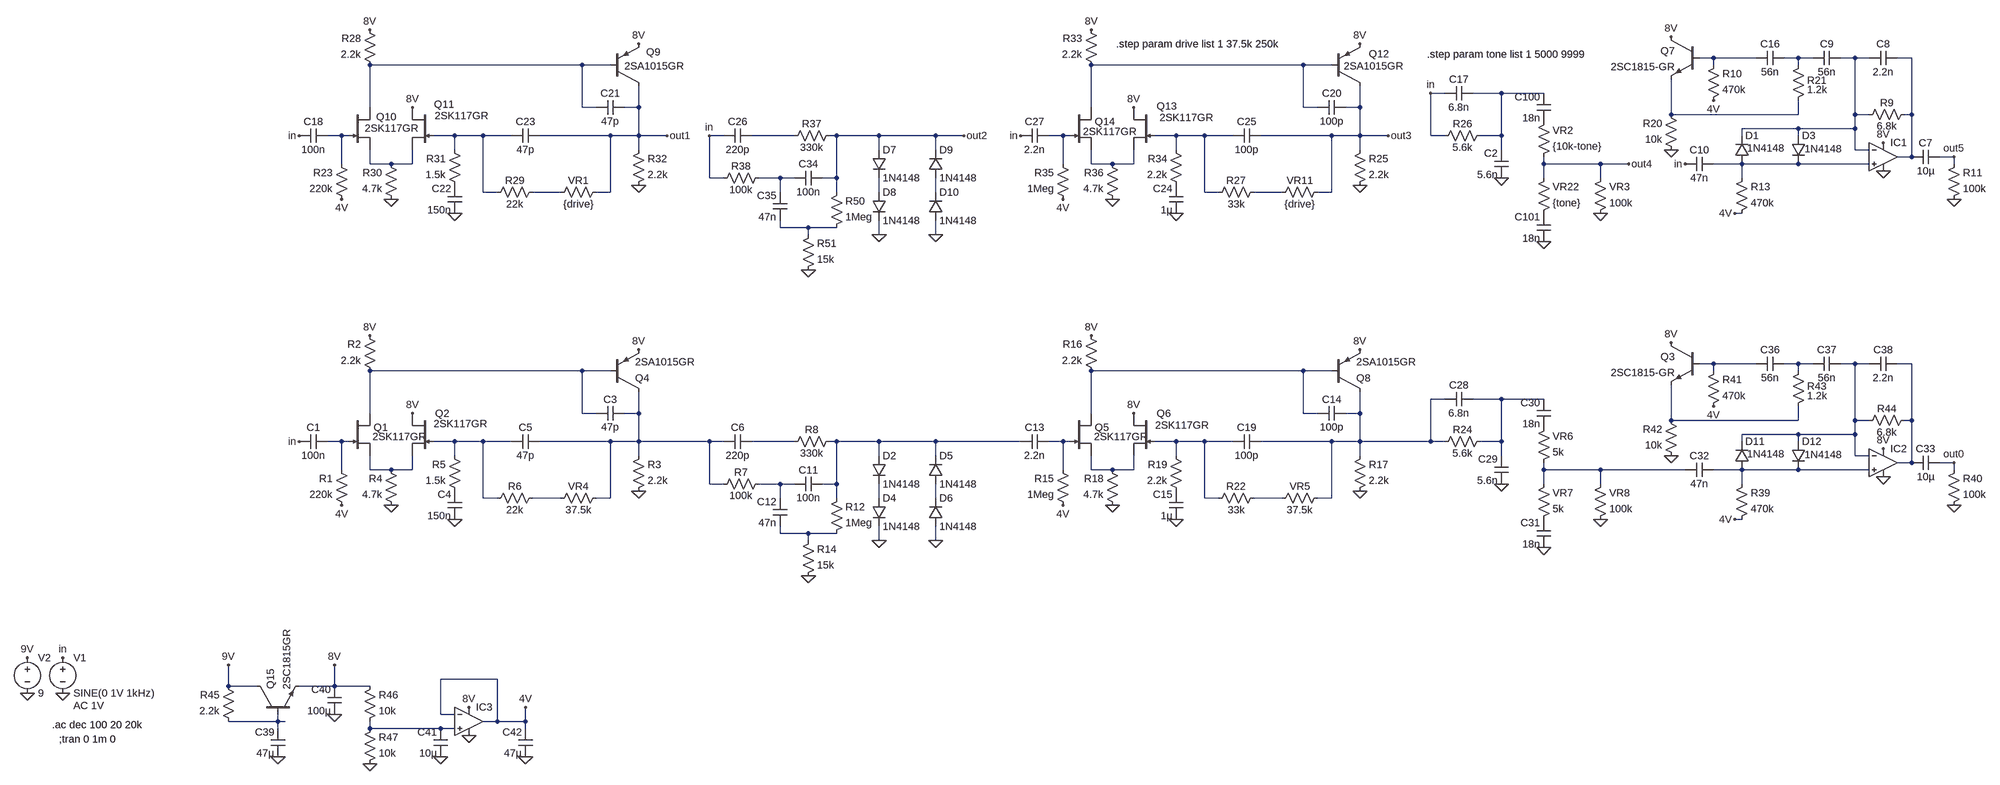
[diagram p0: schematic bd2.asc]
bd2.asc, the LTspice schematic file:
Version 4
SHEET 1 3148 1828
WIRE 2144 48 2112 48
WIRE 2240 48 2144 48
WIRE 2336 48 2304 48
WIRE 2368 48 2336 48
WIRE 2464 48 2432 48
WIRE 2496 48 2464 48
WIRE 2592 48 2560 48
WIRE -416 64 -896 64
WIRE -352 64 -416 64
WIRE 1216 64 736 64
WIRE 1280 64 1216 64
WIRE 2144 64 2144 48
WIRE 2336 64 2336 48
WIRE 1536 128 1504 128
WIRE 1664 128 1600 128
WIRE 1760 128 1664 128
WIRE -896 160 -896 64
WIRE -416 160 -416 64
WIRE -384 160 -416 160
WIRE -288 160 -288 112
WIRE -288 160 -320 160
WIRE 736 160 736 64
WIRE 1216 160 1216 64
WIRE 1248 160 1216 160
WIRE 1344 160 1344 112
WIRE 1344 160 1312 160
WIRE 2048 176 2048 96
WIRE 2336 176 2336 144
WIRE 2336 176 2048 176
WIRE 2464 176 2464 48
WIRE 2496 176 2464 176
WIRE 2592 176 2592 48
WIRE 2592 176 2576 176
WIRE 2336 208 2208 208
WIRE 2464 208 2464 176
WIRE 2464 208 2336 208
WIRE -960 224 -992 224
WIRE -944 224 -960 224
WIRE -704 224 -752 224
WIRE -640 224 -704 224
WIRE -576 224 -640 224
WIRE -352 224 -512 224
WIRE -288 224 -288 160
WIRE -288 224 -352 224
WIRE -224 224 -288 224
WIRE -96 224 -128 224
WIRE 64 224 -32 224
WIRE 160 224 144 224
WIRE 256 224 160 224
WIRE 384 224 256 224
WIRE 448 224 384 224
WIRE 672 224 640 224
WIRE 688 224 672 224
WIRE 928 224 880 224
WIRE 992 224 928 224
WIRE 1056 224 992 224
WIRE 1280 224 1120 224
WIRE 1344 224 1344 160
WIRE 1344 224 1280 224
WIRE 1408 224 1344 224
WIRE 1504 224 1504 128
WIRE 1536 224 1504 224
WIRE 1664 224 1664 128
WIRE 1664 224 1616 224
WIRE 2208 224 2208 208
WIRE 2336 224 2336 208
WIRE -704 256 -704 224
WIRE -288 256 -288 224
WIRE 256 256 256 224
WIRE 384 256 384 224
WIRE 928 256 928 224
WIRE 1344 256 1344 224
WIRE 1664 256 1664 224
WIRE 2464 256 2464 208
WIRE 2496 256 2464 256
WIRE 2592 272 2592 176
WIRE 2592 272 2560 272
WIRE 2688 272 2656 272
WIRE -960 288 -960 224
WIRE -896 288 -896 256
WIRE -848 288 -896 288
WIRE -800 288 -800 256
WIRE -800 288 -848 288
WIRE 672 288 672 224
WIRE 736 288 736 256
WIRE 784 288 736 288
WIRE 832 288 832 256
WIRE 832 288 784 288
WIRE 1760 288 1760 272
WIRE 1888 288 1760 288
WIRE 1952 288 1888 288
WIRE 2208 288 2144 288
WIRE 2336 288 2208 288
WIRE 2496 288 2336 288
WIRE 2688 288 2688 272
WIRE -128 320 -128 224
WIRE -96 320 -128 320
WIRE 32 320 -16 320
WIRE 64 320 32 320
WIRE 160 320 160 224
WIRE 160 320 128 320
WIRE 1760 320 1760 288
WIRE 1888 320 1888 288
WIRE 2208 320 2208 288
WIRE -640 352 -640 224
WIRE -608 352 -640 352
WIRE -464 352 -528 352
WIRE -352 352 -352 224
WIRE -352 352 -384 352
WIRE 32 352 32 320
WIRE 160 352 160 320
WIRE 256 352 256 320
WIRE 384 352 384 320
WIRE 992 352 992 224
WIRE 1024 352 992 352
WIRE 1168 352 1104 352
WIRE 1280 352 1280 224
WIRE 1280 352 1248 352
WIRE 2208 400 2192 400
WIRE 32 432 32 416
WIRE 96 432 32 432
WIRE 160 432 96 432
WIRE 96 448 96 432
WIRE 256 448 256 416
WIRE 384 448 384 416
WIRE 2144 864 2112 864
WIRE 2240 864 2144 864
WIRE 2336 864 2304 864
WIRE 2368 864 2336 864
WIRE 2464 864 2432 864
WIRE 2496 864 2464 864
WIRE 2592 864 2560 864
WIRE -416 880 -896 880
WIRE -352 880 -416 880
WIRE 1216 880 736 880
WIRE 1280 880 1216 880
WIRE 2144 880 2144 864
WIRE 2336 880 2336 864
WIRE 1536 944 1504 944
WIRE 1664 944 1600 944
WIRE 1760 944 1664 944
WIRE -896 976 -896 880
WIRE -416 976 -416 880
WIRE -384 976 -416 976
WIRE -288 976 -288 928
WIRE -288 976 -320 976
WIRE 736 976 736 880
WIRE 1216 976 1216 880
WIRE 1248 976 1216 976
WIRE 1344 976 1344 928
WIRE 1344 976 1312 976
WIRE 2048 992 2048 912
WIRE 2336 992 2336 960
WIRE 2336 992 2048 992
WIRE 2464 992 2464 864
WIRE 2496 992 2464 992
WIRE 2592 992 2592 864
WIRE 2592 992 2576 992
WIRE 2336 1024 2208 1024
WIRE 2464 1024 2464 992
WIRE 2464 1024 2336 1024
WIRE -960 1040 -992 1040
WIRE -944 1040 -960 1040
WIRE -704 1040 -752 1040
WIRE -640 1040 -704 1040
WIRE -576 1040 -640 1040
WIRE -352 1040 -512 1040
WIRE -288 1040 -288 976
WIRE -288 1040 -352 1040
WIRE -128 1040 -288 1040
WIRE -96 1040 -128 1040
WIRE 64 1040 -32 1040
WIRE 160 1040 144 1040
WIRE 256 1040 160 1040
WIRE 384 1040 256 1040
WIRE 576 1040 384 1040
WIRE 672 1040 640 1040
WIRE 688 1040 672 1040
WIRE 928 1040 880 1040
WIRE 992 1040 928 1040
WIRE 1056 1040 992 1040
WIRE 1280 1040 1120 1040
WIRE 1344 1040 1344 976
WIRE 1344 1040 1280 1040
WIRE 1504 1040 1504 944
WIRE 1504 1040 1344 1040
WIRE 1536 1040 1504 1040
WIRE 1664 1040 1664 944
WIRE 1664 1040 1616 1040
WIRE 2208 1040 2208 1024
WIRE 2336 1040 2336 1024
WIRE -704 1072 -704 1040
WIRE -288 1072 -288 1040
WIRE 256 1072 256 1040
WIRE 384 1072 384 1040
WIRE 928 1072 928 1040
WIRE 1344 1072 1344 1040
WIRE 1664 1072 1664 1040
WIRE 2464 1072 2464 1024
WIRE 2496 1072 2464 1072
WIRE 2592 1088 2592 992
WIRE 2592 1088 2560 1088
WIRE 2688 1088 2656 1088
WIRE -960 1104 -960 1040
WIRE -896 1104 -896 1072
WIRE -848 1104 -896 1104
WIRE -800 1104 -800 1072
WIRE -800 1104 -848 1104
WIRE 672 1104 672 1040
WIRE 736 1104 736 1072
WIRE 784 1104 736 1104
WIRE 832 1104 832 1072
WIRE 832 1104 784 1104
WIRE 1760 1104 1760 1088
WIRE 1888 1104 1760 1104
WIRE 2080 1104 1888 1104
WIRE 2208 1104 2144 1104
WIRE 2336 1104 2208 1104
WIRE 2496 1104 2336 1104
WIRE 2688 1104 2688 1088
WIRE -128 1136 -128 1040
WIRE -96 1136 -128 1136
WIRE 32 1136 -16 1136
WIRE 64 1136 32 1136
WIRE 160 1136 160 1040
WIRE 160 1136 128 1136
WIRE 1760 1136 1760 1104
WIRE 1888 1136 1888 1104
WIRE 2208 1136 2208 1104
WIRE -640 1168 -640 1040
WIRE -608 1168 -640 1168
WIRE -464 1168 -528 1168
WIRE -352 1168 -352 1040
WIRE -352 1168 -384 1168
WIRE 32 1168 32 1136
WIRE 160 1168 160 1136
WIRE 256 1168 256 1136
WIRE 384 1168 384 1136
WIRE 992 1168 992 1040
WIRE 1024 1168 992 1168
WIRE 1168 1168 1104 1168
WIRE 1280 1168 1280 1040
WIRE 1280 1168 1248 1168
WIRE 2208 1216 2192 1216
WIRE 32 1248 32 1232
WIRE 96 1248 32 1248
WIRE 160 1248 96 1248
WIRE 96 1264 96 1248
WIRE 256 1264 256 1232
WIRE 384 1264 384 1232
WIRE -608 1616 -736 1616
WIRE -1216 1632 -1216 1584
WIRE -1152 1632 -1216 1632
WIRE -976 1632 -976 1584
WIRE -976 1632 -1056 1632
WIRE -896 1632 -976 1632
WIRE -736 1696 -736 1616
WIRE -704 1696 -736 1696
WIRE -1104 1712 -1104 1696
WIRE -1104 1712 -1216 1712
WIRE -1088 1712 -1104 1712
WIRE -608 1712 -608 1616
WIRE -608 1712 -640 1712
WIRE -544 1712 -544 1680
WIRE -544 1712 -608 1712
WIRE -1104 1728 -1104 1712
WIRE -896 1728 -896 1712
WIRE -736 1728 -896 1728
WIRE -704 1728 -736 1728
WIRE -544 1728 -544 1712
FLAG -1616 1648 0
FLAG -1616 1568 in
FLAG -224 224 out1
FLAG -848 368 0
FLAG -704 400 0
FLAG -288 336 0
FLAG -960 368 4V
FLAG -800 160 8V
FLAG -896 -16 8V
FLAG -288 16 8V
FLAG -1056 224 in
FLAG 96 528 0
FLAG -128 224 in
FLAG 448 224 out2
FLAG 256 448 0
FLAG 384 448 0
FLAG 1408 224 out3
FLAG 784 368 0
FLAG 928 400 0
FLAG 1344 336 0
FLAG 672 368 4V
FLAG 832 160 8V
FLAG 736 -16 8V
FLAG 1344 16 8V
FLAG 576 224 in
FLAG 1664 320 0
FLAG 1760 464 0
FLAG 1888 400 0
FLAG 1952 288 out4
FLAG 1504 128 in
FLAG 2192 400 4V
FLAG 2528 304 0
FLAG 2528 240 8V
FLAG 2688 368 0
FLAG 2048 0 8V
FLAG 2048 256 0
FLAG 2144 144 4V
FLAG 2688 272 out5
FLAG 2080 288 in
FLAG -848 1184 0
FLAG -704 1216 0
FLAG -288 1152 0
FLAG -960 1184 4V
FLAG -800 976 8V
FLAG -896 800 8V
FLAG -288 832 8V
FLAG -1056 1040 in
FLAG 96 1344 0
FLAG 256 1264 0
FLAG 384 1264 0
FLAG 784 1184 0
FLAG 928 1216 0
FLAG 1344 1152 0
FLAG 672 1184 4V
FLAG 832 976 8V
FLAG 736 800 8V
FLAG 1344 832 8V
FLAG 1664 1136 0
FLAG 1760 1280 0
FLAG 1888 1216 0
FLAG 2688 1088 out0
FLAG -1104 1792 0
FLAG -976 1696 0
FLAG -976 1584 8V
FLAG 2192 1216 4V
FLAG 2528 1120 0
FLAG 2528 1056 8V
FLAG 2688 1184 0
FLAG 2048 816 8V
FLAG 2048 1072 0
FLAG 2144 960 4V
FLAG -896 1808 0
FLAG -736 1792 0
FLAG -672 1744 0
FLAG -672 1680 8V
FLAG -544 1792 0
FLAG -544 1680 4V
FLAG -1216 1584 9V
FLAG -1696 1648 0
FLAG -1696 1568 9V
SYMBOL res -944 384 R180
WINDOW 0 36 76 Left 2
WINDOW 3 36 40 Left 2
SYMATTR InstName R23
SYMATTR Value 220k
SYMBOL cap -992 208 R90
WINDOW 0 0 32 VBottom 2
WINDOW 3 32 32 VTop 2
SYMATTR InstName C18
SYMATTR Value 100n
SYMBOL voltage -1616 1552 R0
WINDOW 123 24 124 Left 2
WINDOW 39 0 0 Left 2
SYMATTR Value2 AC 1V
SYMATTR InstName V1
SYMATTR Value SINE(0 1V 1kHz)
SYMBOL res -880 80 R180
WINDOW 0 36 76 Left 2
WINDOW 3 36 40 Left 2
SYMATTR InstName R28
SYMATTR Value 2.2k
SYMBOL res -304 352 M180
WINDOW 0 36 76 Left 2
WINDOW 3 36 40 Left 2
SYMATTR InstName R32
SYMATTR Value 2.2k
SYMBOL njf -944 160 R0
WINDOW 3 36 47 Left 2
WINDOW 0 62 21 Left 2
SYMATTR Value 2SK117GR
SYMATTR InstName Q10
SYMBOL njf -752 160 M0
WINDOW 0 -47 -7 Left 2
WINDOW 3 -124 19 Left 2
SYMATTR InstName Q11
SYMATTR Value 2SK117GR
SYMBOL pnp -352 112 M180
WINDOW 0 81 77 Left 2
WINDOW 3 32 46 Left 2
SYMATTR InstName Q9
SYMATTR Value 2SA1015GR
SYMBOL cap -320 144 R90
WINDOW 0 0 32 VBottom 2
WINDOW 3 32 32 VTop 2
SYMATTR InstName C21
SYMATTR Value 47p
SYMBOL cap -688 400 R180
WINDOW 0 24 56 Left 2
WINDOW 3 24 8 Left 2
SYMATTR InstName C22
SYMATTR Value 150n
SYMBOL res -832 384 R180
WINDOW 0 36 76 Left 2
WINDOW 3 36 40 Left 2
SYMATTR InstName R30
SYMATTR Value 4.7k
SYMBOL cap -512 208 R90
WINDOW 0 0 32 VBottom 2
WINDOW 3 32 32 VTop 2
SYMATTR InstName C23
SYMATTR Value 47p
SYMBOL res -688 352 R180
WINDOW 0 36 76 Left 2
WINDOW 3 36 40 Left 2
SYMATTR InstName R31
SYMATTR Value 1.5k
SYMBOL res -512 336 R90
WINDOW 0 5 56 VBottom 2
WINDOW 3 27 56 VTop 2
SYMATTR InstName R29
SYMATTR Value 22k
SYMBOL res -368 336 R90
WINDOW 0 5 56 VBottom 2
WINDOW 3 27 56 VTop 2
SYMATTR InstName VR1
SYMATTR Value {drive}
SYMBOL cap -32 208 R90
WINDOW 0 0 32 VBottom 2
WINDOW 3 32 32 VTop 2
SYMATTR InstName C26
SYMATTR Value 220p
SYMBOL res 0 304 R90
WINDOW 0 5 56 VBottom 2
WINDOW 3 27 56 VTop 2
SYMATTR InstName R38
SYMATTR Value 100k
SYMBOL res 160 208 R90
WINDOW 0 5 56 VBottom 2
WINDOW 3 27 56 VTop 2
SYMATTR InstName R37
SYMATTR Value 330k
SYMBOL cap 128 304 R90
WINDOW 0 0 32 VBottom 2
WINDOW 3 32 32 VTop 2
SYMATTR InstName C34
SYMATTR Value 100n
SYMBOL res 144 448 M180
WINDOW 0 36 76 Left 2
WINDOW 3 36 40 Left 2
SYMATTR InstName R50
SYMATTR Value 1Meg
SYMBOL cap 48 416 R180
WINDOW 0 24 56 Left 2
WINDOW 3 24 8 Left 2
SYMATTR InstName C35
SYMATTR Value 47n
SYMBOL res 80 544 M180
WINDOW 0 36 76 Left 2
WINDOW 3 36 40 Left 2
SYMATTR InstName R51
SYMATTR Value 15k
SYMBOL diode 240 256 R0
SYMATTR InstName D7
SYMATTR Value 1N4148
SYMBOL diode 240 352 R0
SYMATTR InstName D8
SYMATTR Value 1N4148
SYMBOL diode 368 320 M180
WINDOW 0 24 64 Left 2
WINDOW 3 24 0 Left 2
SYMATTR InstName D9
SYMATTR Value 1N4148
SYMBOL diode 368 416 M180
WINDOW 0 24 64 Left 2
WINDOW 3 24 0 Left 2
SYMATTR InstName D10
SYMATTR Value 1N4148
SYMBOL res 688 384 R180
WINDOW 0 36 76 Left 2
WINDOW 3 36 40 Left 2
SYMATTR InstName R35
SYMATTR Value 1Meg
SYMBOL cap 640 208 R90
WINDOW 0 0 32 VBottom 2
WINDOW 3 32 32 VTop 2
SYMATTR InstName C27
SYMATTR Value 2.2n
SYMBOL res 752 80 R180
WINDOW 0 36 76 Left 2
WINDOW 3 36 40 Left 2
SYMATTR InstName R33
SYMATTR Value 2.2k
SYMBOL res 1328 352 M180
WINDOW 0 36 76 Left 2
WINDOW 3 36 40 Left 2
SYMATTR InstName R25
SYMATTR Value 2.2k
SYMBOL njf 688 160 R0
WINDOW 3 29 55 Left 2
SYMATTR Value 2SK117GR
SYMATTR InstName Q14
SYMBOL njf 880 160 M0
WINDOW 0 -50 -3 Left 2
WINDOW 3 -132 23 Left 2
SYMATTR InstName Q13
SYMATTR Value 2SK117GR
SYMBOL pnp 1280 112 M180
WINDOW 0 84 73 Left 2
WINDOW 3 27 46 Left 2
SYMATTR InstName Q12
SYMATTR Value 2SA1015GR
SYMBOL cap 1312 144 R90
WINDOW 0 0 32 VBottom 2
WINDOW 3 32 32 VTop 2
SYMATTR InstName C20
SYMATTR Value 100p
SYMBOL cap 944 400 R180
WINDOW 0 24 56 Left 2
WINDOW 3 24 8 Left 2
SYMATTR InstName C24
SYMATTR Value 1µ
SYMBOL res 800 384 R180
WINDOW 0 36 76 Left 2
WINDOW 3 36 40 Left 2
SYMATTR InstName R36
SYMATTR Value 4.7k
SYMBOL cap 1120 208 R90
WINDOW 0 0 32 VBottom 2
WINDOW 3 32 32 VTop 2
SYMATTR InstName C25
SYMATTR Value 100p
SYMBOL res 944 352 R180
WINDOW 0 36 76 Left 2
WINDOW 3 36 40 Left 2
SYMATTR InstName R34
SYMATTR Value 2.2k
SYMBOL res 1120 336 R90
WINDOW 0 5 56 VBottom 2
WINDOW 3 27 56 VTop 2
SYMATTR InstName R27
SYMATTR Value 33k
SYMBOL res 1264 336 R90
WINDOW 0 5 56 VBottom 2
WINDOW 3 27 56 VTop 2
SYMATTR InstName VR11
SYMATTR Value {drive}
SYMBOL res 1632 208 R90
WINDOW 0 5 56 VBottom 2
WINDOW 3 27 56 VTop 2
SYMATTR InstName R26
SYMATTR Value 5.6k
SYMBOL cap 1600 112 R90
WINDOW 0 0 32 VBottom 2
WINDOW 3 32 32 VTop 2
SYMATTR InstName C17
SYMATTR Value 6.8n
SYMBOL cap 1680 320 R180
WINDOW 0 24 56 Left 2
WINDOW 3 24 8 Left 2
SYMATTR InstName C2
SYMATTR Value 5.6n
SYMBOL cap 1776 192 R180
WINDOW 0 24 56 Left 2
WINDOW 3 24 8 Left 2
SYMATTR InstName C100
SYMATTR Value 18n
SYMBOL res 1744 288 M180
WINDOW 0 36 76 Left 2
WINDOW 3 36 40 Left 2
SYMATTR InstName VR2
SYMATTR Value {10k-tone}
SYMBOL res 1744 416 M180
WINDOW 0 36 76 Left 2
WINDOW 3 36 40 Left 2
SYMATTR InstName VR22
SYMATTR Value {tone}
SYMBOL cap 1776 464 R180
WINDOW 0 24 56 Left 2
WINDOW 3 24 8 Left 2
SYMATTR InstName C101
SYMATTR Value 18n
SYMBOL res 1872 416 M180
WINDOW 0 36 76 Left 2
WINDOW 3 36 40 Left 2
SYMATTR InstName VR3
SYMATTR Value 100k
SYMBOL cap 2144 272 R90
WINDOW 0 0 32 VBottom 2
WINDOW 3 32 32 VTop 2
SYMATTR InstName C10
SYMATTR Value 47n
SYMBOL res 2192 416 M180
WINDOW 0 36 76 Left 2
WINDOW 3 36 40 Left 2
SYMATTR InstName R13
SYMATTR Value 470k
SYMBOL diode 2192 288 M180
WINDOW 0 24 64 Left 2
WINDOW 3 28 36 Left 2
SYMATTR InstName D1
SYMATTR Value 1N4148
SYMBOL diode 2320 224 R0
WINDOW 3 30 30 Left 2
SYMATTR Value 1N4148
SYMATTR InstName D3
SYMBOL Opamps\\UniversalOpamp2 2528 272 R0
SYMATTR InstName IC1
SYMBOL cap 2656 256 R90
WINDOW 0 0 32 VBottom 2
WINDOW 3 32 32 VTop 2
SYMATTR InstName C7
SYMATTR Value 10µ
SYMBOL res 2672 384 M180
WINDOW 0 36 76 Left 2
WINDOW 3 36 40 Left 2
SYMATTR InstName R11
SYMATTR Value 100k
SYMBOL cap 2304 32 R90
WINDOW 0 0 32 VBottom 2
WINDOW 3 32 32 VTop 2
SYMATTR InstName C16
SYMATTR Value 56n
SYMBOL npn 2112 0 M0
SYMATTR InstName Q7
SYMATTR Value 2SC1815-GR
SYMBOL res 2128 160 M180
WINDOW 0 36 76 Left 2
WINDOW 3 36 40 Left 2
SYMATTR InstName R10
SYMATTR Value 470k
SYMBOL res 2064 272 R180
WINDOW 0 36 76 Left 2
WINDOW 3 36 40 Left 2
SYMATTR InstName R20
SYMATTR Value 10k
SYMBOL cap 2432 32 R90
WINDOW 0 0 32 VBottom 2
WINDOW 3 32 32 VTop 2
SYMATTR InstName C9
SYMATTR Value 56n
SYMBOL res 2320 160 M180
WINDOW 0 36 61 Left 2
WINDOW 3 36 40 Left 2
SYMATTR InstName R21
SYMATTR Value 1.2k
SYMBOL cap 2560 32 R90
WINDOW 0 0 32 VBottom 2
WINDOW 3 32 32 VTop 2
SYMATTR InstName C8
SYMATTR Value 2.2n
SYMBOL res 2592 160 R90
WINDOW 0 5 56 VBottom 2
WINDOW 3 27 56 VTop 2
SYMATTR InstName R9
SYMATTR Value 6.8k
SYMBOL res -944 1200 R180
WINDOW 0 36 76 Left 2
WINDOW 3 36 40 Left 2
SYMATTR InstName R1
SYMATTR Value 220k
SYMBOL cap -992 1024 R90
WINDOW 0 0 32 VBottom 2
WINDOW 3 32 32 VTop 2
SYMATTR InstName C1
SYMATTR Value 100n
SYMBOL res -880 896 R180
WINDOW 0 36 76 Left 2
WINDOW 3 36 40 Left 2
SYMATTR InstName R2
SYMATTR Value 2.2k
SYMBOL res -304 1168 M180
WINDOW 0 36 76 Left 2
WINDOW 3 36 40 Left 2
SYMATTR InstName R3
SYMATTR Value 2.2k
SYMBOL njf -944 976 R0
WINDOW 3 54 53 Left 2
SYMATTR Value 2SK117GR
SYMATTR InstName Q1
SYMBOL njf -752 976 M0
WINDOW 0 -36 0 Left 2
WINDOW 3 -122 24 Left 2
SYMATTR InstName Q2
SYMATTR Value 2SK117GR
SYMBOL pnp -352 928 M180
SYMATTR InstName Q4
SYMATTR Value 2SA1015GR
SYMBOL cap -320 960 R90
WINDOW 0 0 32 VBottom 2
WINDOW 3 32 32 VTop 2
SYMATTR InstName C3
SYMATTR Value 47p
SYMBOL cap -688 1216 R180
WINDOW 0 24 56 Left 2
WINDOW 3 24 8 Left 2
SYMATTR InstName C4
SYMATTR Value 150n
SYMBOL res -832 1200 R180
WINDOW 0 36 76 Left 2
WINDOW 3 36 40 Left 2
SYMATTR InstName R4
SYMATTR Value 4.7k
SYMBOL cap -512 1024 R90
WINDOW 0 0 32 VBottom 2
WINDOW 3 32 32 VTop 2
SYMATTR InstName C5
SYMATTR Value 47p
SYMBOL res -688 1168 R180
WINDOW 0 36 76 Left 2
WINDOW 3 36 40 Left 2
SYMATTR InstName R5
SYMATTR Value 1.5k
SYMBOL res -512 1152 R90
WINDOW 0 5 56 VBottom 2
WINDOW 3 27 56 VTop 2
SYMATTR InstName R6
SYMATTR Value 22k
SYMBOL res -368 1152 R90
WINDOW 0 5 56 VBottom 2
WINDOW 3 27 56 VTop 2
SYMATTR InstName VR4
SYMATTR Value 37.5k
SYMBOL cap -32 1024 R90
WINDOW 0 0 32 VBottom 2
WINDOW 3 32 32 VTop 2
SYMATTR InstName C6
SYMATTR Value 220p
SYMBOL res 0 1120 R90
WINDOW 0 5 56 VBottom 2
WINDOW 3 27 56 VTop 2
SYMATTR InstName R7
SYMATTR Value 100k
SYMBOL res 160 1024 R90
WINDOW 0 5 56 VBottom 2
WINDOW 3 27 56 VTop 2
SYMATTR InstName R8
SYMATTR Value 330k
SYMBOL cap 128 1120 R90
WINDOW 0 0 32 VBottom 2
WINDOW 3 32 32 VTop 2
SYMATTR InstName C11
SYMATTR Value 100n
SYMBOL res 144 1264 M180
WINDOW 0 36 76 Left 2
WINDOW 3 36 40 Left 2
SYMATTR InstName R12
SYMATTR Value 1Meg
SYMBOL cap 48 1232 R180
WINDOW 0 24 56 Left 2
WINDOW 3 24 8 Left 2
SYMATTR InstName C12
SYMATTR Value 47n
SYMBOL res 80 1360 M180
WINDOW 0 36 76 Left 2
WINDOW 3 36 40 Left 2
SYMATTR InstName R14
SYMATTR Value 15k
SYMBOL diode 240 1072 R0
SYMATTR InstName D2
SYMATTR Value 1N4148
SYMBOL diode 240 1168 R0
SYMATTR InstName D4
SYMATTR Value 1N4148
SYMBOL diode 368 1136 M180
WINDOW 0 24 64 Left 2
WINDOW 3 24 0 Left 2
SYMATTR InstName D5
SYMATTR Value 1N4148
SYMBOL diode 368 1232 M180
WINDOW 0 24 64 Left 2
WINDOW 3 24 0 Left 2
SYMATTR InstName D6
SYMATTR Value 1N4148
SYMBOL res 688 1200 R180
WINDOW 0 36 76 Left 2
WINDOW 3 36 40 Left 2
SYMATTR InstName R15
SYMATTR Value 1Meg
SYMBOL cap 640 1024 R90
WINDOW 0 0 32 VBottom 2
WINDOW 3 32 32 VTop 2
SYMATTR InstName C13
SYMATTR Value 2.2n
SYMBOL res 752 896 R180
WINDOW 0 36 76 Left 2
WINDOW 3 36 40 Left 2
SYMATTR InstName R16
SYMATTR Value 2.2k
SYMBOL res 1328 1168 M180
WINDOW 0 36 76 Left 2
WINDOW 3 36 40 Left 2
SYMATTR InstName R17
SYMATTR Value 2.2k
SYMBOL njf 688 976 R0
WINDOW 3 54 53 Left 2
SYMATTR Value 2SK117GR
SYMATTR InstName Q5
SYMBOL njf 880 976 M0
WINDOW 0 -36 0 Left 2
WINDOW 3 -122 27 Left 2
SYMATTR InstName Q6
SYMATTR Value 2SK117GR
SYMBOL pnp 1280 928 M180
SYMATTR InstName Q8
SYMATTR Value 2SA1015GR
SYMBOL cap 1312 960 R90
WINDOW 0 0 32 VBottom 2
WINDOW 3 32 32 VTop 2
SYMATTR InstName C14
SYMATTR Value 100p
SYMBOL cap 944 1216 R180
WINDOW 0 24 56 Left 2
WINDOW 3 24 8 Left 2
SYMATTR InstName C15
SYMATTR Value 1µ
SYMBOL res 800 1200 R180
WINDOW 0 36 76 Left 2
WINDOW 3 36 40 Left 2
SYMATTR InstName R18
SYMATTR Value 4.7k
SYMBOL cap 1120 1024 R90
WINDOW 0 0 32 VBottom 2
WINDOW 3 32 32 VTop 2
SYMATTR InstName C19
SYMATTR Value 100p
SYMBOL res 944 1168 R180
WINDOW 0 36 76 Left 2
WINDOW 3 36 40 Left 2
SYMATTR InstName R19
SYMATTR Value 2.2k
SYMBOL res 1120 1152 R90
WINDOW 0 5 56 VBottom 2
WINDOW 3 27 56 VTop 2
SYMATTR InstName R22
SYMATTR Value 33k
SYMBOL res 1264 1152 R90
WINDOW 0 5 56 VBottom 2
WINDOW 3 27 56 VTop 2
SYMATTR InstName VR5
SYMATTR Value 37.5k
SYMBOL res 1632 1024 R90
WINDOW 0 5 56 VBottom 2
WINDOW 3 27 56 VTop 2
SYMATTR InstName R24
SYMATTR Value 5.6k
SYMBOL cap 1600 928 R90
WINDOW 0 0 32 VBottom 2
WINDOW 3 32 32 VTop 2
SYMATTR InstName C28
SYMATTR Value 6.8n
SYMBOL cap 1680 1136 R180
WINDOW 0 24 56 Left 2
WINDOW 3 24 8 Left 2
SYMATTR InstName C29
SYMATTR Value 5.6n
SYMBOL cap 1776 1008 R180
WINDOW 0 24 56 Left 2
WINDOW 3 24 8 Left 2
SYMATTR InstName C30
SYMATTR Value 18n
SYMBOL res 1744 1104 M180
WINDOW 0 36 76 Left 2
WINDOW 3 36 40 Left 2
SYMATTR InstName VR6
SYMATTR Value 5k
SYMBOL res 1744 1232 M180
WINDOW 0 36 76 Left 2
WINDOW 3 36 40 Left 2
SYMATTR InstName VR7
SYMATTR Value 5k
SYMBOL cap 1776 1280 R180
WINDOW 0 24 56 Left 2
WINDOW 3 24 8 Left 2
SYMATTR InstName C31
SYMATTR Value 18n
SYMBOL res 1872 1232 M180
WINDOW 0 36 76 Left 2
WINDOW 3 36 40 Left 2
SYMATTR InstName VR8
SYMATTR Value 100k
SYMBOL npn -1152 1696 R270
SYMATTR InstName Q15
SYMATTR Value 2SC1815GR
SYMBOL res -1200 1728 R180
WINDOW 0 36 76 Left 2
WINDOW 3 36 40 Left 2
SYMATTR InstName R45
SYMATTR Value 2.2k
SYMBOL cap -1088 1792 R180
WINDOW 0 24 56 Left 2
WINDOW 3 24 8 Left 2
SYMATTR InstName C39
SYMATTR Value 47µ
SYMBOL cap -960 1696 R180
WINDOW 0 24 56 Left 2
WINDOW 3 24 8 Left 2
SYMATTR InstName C40
SYMATTR Value 100µ
SYMBOL cap 2144 1088 R90
WINDOW 0 0 32 VBottom 2
WINDOW 3 32 32 VTop 2
SYMATTR InstName C32
SYMATTR Value 47n
SYMBOL res 2192 1232 M180
WINDOW 0 36 76 Left 2
WINDOW 3 36 40 Left 2
SYMATTR InstName R39
SYMATTR Value 470k
SYMBOL diode 2192 1104 M180
WINDOW 0 24 64 Left 2
WINDOW 3 28 36 Left 2
SYMATTR InstName D11
SYMATTR Value 1N4148
SYMBOL diode 2320 1040 R0
WINDOW 3 30 30 Left 2
SYMATTR Value 1N4148
SYMATTR InstName D12
SYMBOL Opamps\\UniversalOpamp2 2528 1088 R0
SYMATTR InstName IC2
SYMBOL cap 2656 1072 R90
WINDOW 0 0 32 VBottom 2
WINDOW 3 32 32 VTop 2
SYMATTR InstName C33
SYMATTR Value 10µ
SYMBOL res 2672 1200 M180
WINDOW 0 36 76 Left 2
WINDOW 3 36 40 Left 2
SYMATTR InstName R40
SYMATTR Value 100k
SYMBOL cap 2304 848 R90
WINDOW 0 0 32 VBottom 2
WINDOW 3 32 32 VTop 2
SYMATTR InstName C36
SYMATTR Value 56n
SYMBOL npn 2112 816 M0
SYMATTR InstName Q3
SYMATTR Value 2SC1815-GR
SYMBOL res 2128 976 M180
WINDOW 0 36 76 Left 2
WINDOW 3 36 40 Left 2
SYMATTR InstName R41
SYMATTR Value 470k
SYMBOL res 2064 1088 R180
WINDOW 0 36 76 Left 2
WINDOW 3 36 40 Left 2
SYMATTR InstName R42
SYMATTR Value 10k
SYMBOL cap 2432 848 R90
WINDOW 0 0 32 VBottom 2
WINDOW 3 32 32 VTop 2
SYMATTR InstName C37
SYMATTR Value 56n
SYMBOL res 2320 976 M180
WINDOW 0 36 61 Left 2
WINDOW 3 36 40 Left 2
SYMATTR InstName R43
SYMATTR Value 1.2k
SYMBOL cap 2560 848 R90
WINDOW 0 0 32 VBottom 2
WINDOW 3 32 32 VTop 2
SYMATTR InstName C38
SYMATTR Value 2.2n
SYMBOL res 2592 976 R90
WINDOW 0 5 56 VBottom 2
WINDOW 3 27 56 VTop 2
SYMATTR InstName R44
SYMATTR Value 6.8k
SYMBOL res -912 1728 M180
WINDOW 0 36 76 Left 2
WINDOW 3 36 40 Left 2
SYMATTR InstName R46
SYMATTR Value 10k
SYMBOL res -912 1824 M180
WINDOW 0 36 76 Left 2
WINDOW 3 36 40 Left 2
SYMATTR InstName R47
SYMATTR Value 10k
SYMBOL cap -720 1792 R180
WINDOW 0 24 56 Left 2
WINDOW 3 24 8 Left 2
SYMATTR InstName C41
SYMATTR Value 10µ
SYMBOL Opamps\\UniversalOpamp2 -672 1712 R0
SYMATTR InstName IC3
SYMBOL cap -528 1792 R180
WINDOW 0 24 56 Left 2
WINDOW 3 24 8 Left 2
SYMATTR InstName C42
SYMATTR Value 47µ
SYMBOL voltage -1696 1552 R0
WINDOW 123 0 0 Left 0
WINDOW 39 0 0 Left 0
SYMATTR InstName V2
SYMATTR Value 9
TEXT -1640 1720 Left 2 !.ac dec 100 20 20k
TEXT -1624 1752 Left 2 !;tran 0 1m 0
TEXT 792 16 Left 2 !.step param drive list 1 37.5k 250k
TEXT 1496 40 Left 2 !.step param tone list 1 5000 9999

The netlist it stands for:
* bd2.asc
R23 4V N009 220k
C18 N009 in 100n
V1 in 0 SINE(0 1V 1kHz) AC 1V
R28 N005 8V 2.2k
R32 0 out1 2.2k
J§Q10 N005 N009 N014 2SK117GR
J§Q11 8V N010 N014 2SK117GR
Q9 out1 N005 8V 0 2SA1015GR
C21 out1 N005 47p
C22 0 P001 150n
R30 0 N014 4.7k
C23 out1 N010 47p
R31 P001 N010 1.5k
R29 N018 N010 22k
R§VR1 out1 N018 {drive}
C26 N011 in 220p
R38 N017 in 100k
R37 out2 N011 330k
C34 out2 N017 100n
R50 N022 out2 1Meg
C35 N022 N017 47n
R51 0 N022 15k
D7 out2 N019 1N4148
D8 N019 0 1N4148
D9 N020 out2 1N4148
D10 0 N020 1N4148
R35 4V N012 1Meg
C27 N012 in 2.2n
R33 N006 8V 2.2k
R25 0 out3 2.2k
J§Q14 N006 N012 N015 2SK117GR
J§Q13 8V N013 N015 2SK117GR
Q12 out3 N006 8V 0 2SA1015GR
C20 out3 N006 100p
C24 0 P002 1µ
R36 0 N015 4.7k
C25 out3 N013 100p
R34 P002 N013 2.2k
R27 N021 N013 33k
R§VR11 out3 N021 {drive}
R26 N007 in 5.6k
C17 N007 in 6.8n
C2 0 N007 5.6n
C100 P003 N007 18n
R§VR2 out4 P003 {10k-tone}
R§VR22 P004 out4 {tone}
C101 0 P004 18n
R§VR3 0 out4 100k
C10 N016 in 47n
R13 4V N016 470k
D1 N016 N003 1N4148
D3 N003 N016 1N4148
XIC1 N016 N003 8V 0 N004 level.2 Avol=1Meg GBW=10Meg Slew=10Meg ilimit=25m rail=0 Vos=0 phimargin=45 en=0 enk=0 in=0 ink=0 Rin=500Meg  ; pins IN+ IN- V+ V- OUT
C7 out5 N004 10µ
R11 0 out5 100k
C16 N002 N001 56n
Q7 8V N001 N008 0 2SC1815-GR
R10 4V N001 470k
R20 0 N008 10k
C9 N003 N002 56n
R21 N008 N002 1.2k
C8 N004 N003 2.2n
R9 N004 N003 6.8k
R1 4V N033 220k
C1 N033 in 100n
R2 N027 8V 2.2k
R3 0 N031 2.2k
J§Q1 N027 N033 N039 2SK117GR
J§Q2 8V N034 N039 2SK117GR
Q4 N031 N027 8V 0 2SA1015GR
C3 N031 N027 47p
C4 0 P005 150n
R4 0 N039 4.7k
C5 N031 N034 47p
R5 P005 N034 1.5k
R6 N044 N034 22k
R§VR4 N031 N044 37.5k
C6 N035 N031 220p
R7 N043 N031 100k
R8 N036 N035 330k
C11 N036 N043 100n
R12 N048 N036 1Meg
C12 N048 N043 47n
R14 0 N048 15k
D2 N036 N045 1N4148
D4 N045 0 1N4148
D5 N046 N036 1N4148
D6 0 N046 1N4148
R15 4V N037 1Meg
C13 N037 N036 2.2n
R16 N028 8V 2.2k
R17 0 N029 2.2k
J§Q5 N028 N037 N040 2SK117GR
J§Q6 8V N038 N040 2SK117GR
Q8 N029 N028 8V 0 2SA1015GR
C14 N029 N028 100p
C15 0 P006 1µ
R18 0 N040 4.7k
C19 N029 N038 100p
R19 P006 N038 2.2k
R22 N047 N038 33k
R§VR5 N029 N047 37.5k
R24 N030 N029 5.6k
C28 N030 N029 6.8n
C29 0 N030 5.6n
C30 P007 N030 18n
R§VR6 N041 P007 5k
R§VR7 P008 N041 5k
C31 0 P008 18n
R§VR8 0 N041 100k
Q15 9V N049 8V 0 2SC1815GR
R45 N049 9V 2.2k
C39 0 N049 47µ
C40 0 8V 100µ
C32 N042 N041 47n
R39 4V N042 470k
D11 N042 N025 1N4148
D12 N025 N042 1N4148
XIC2 N042 N025 8V 0 N026 level.2 Avol=1Meg GBW=10Meg Slew=10Meg ilimit=25m rail=0 Vos=0 phimargin=45 en=0 enk=0 in=0 ink=0 Rin=500Meg  ; pins IN+ IN- V+ V- OUT
C33 out0 N026 10µ
R40 0 out0 100k
C36 N024 N023 56n
Q3 8V N023 N032 0 2SC1815-GR
R41 4V N023 470k
R42 0 N032 10k
C37 N025 N024 56n
R43 N032 N024 1.2k
C38 N026 N025 2.2n
R44 N026 N025 6.8k
R46 N050 8V 10k
R47 0 N050 10k
C41 0 N050 10µ
XIC3 N050 4V 8V 0 4V level.2 Avol=1Meg GBW=10Meg Slew=10Meg ilimit=25m rail=0 Vos=0 phimargin=45 en=0 enk=0 in=0 ink=0 Rin=500Meg  ; pins IN+ IN- V+ V- OUT
C42 0 4V 47µ
V2 9V 0 9
.model D D
.lib standard.dio
.model NPN NPN
.model PNP PNP
.lib standard.bjt
.model NJF NJF
.model PJF PJF
.lib standard.jft
.ac dec 100 20 20k
;tran 0 1m 0
.step param drive list 1 37.5k 250k
.step param tone list 1 5000 9999
.lib UniversalOpamps2.sub
.backanno
.end